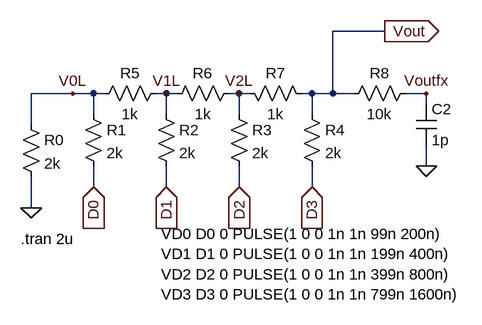
[diagram p0: schematic 4Bit_R2R_DAC.asc]
4Bit_R2R_DAC.asc, the LTspice schematic file:
Version 4
SHEET 1 1212 680
WIRE -48 -480 -128 -480
WIRE -528 -384 -592 -384
WIRE -496 -384 -528 -384
WIRE -480 -384 -496 -384
WIRE -384 -384 -400 -384
WIRE -368 -384 -384 -384
WIRE -272 -384 -288 -384
WIRE -256 -384 -272 -384
WIRE -160 -384 -176 -384
WIRE -128 -384 -128 -480
WIRE -128 -384 -160 -384
WIRE -96 -384 -128 -384
WIRE 16 -384 -16 -384
WIRE 16 -368 16 -384
WIRE -496 -352 -496 -384
WIRE -384 -352 -384 -384
WIRE -272 -352 -272 -384
WIRE -160 -352 -160 -384
WIRE -592 -336 -592 -384
WIRE 16 -272 16 -304
WIRE -496 -240 -496 -272
WIRE -384 -240 -384 -272
WIRE -272 -240 -272 -272
WIRE -160 -240 -160 -272
WIRE -592 -208 -592 -256
FLAG -592 -208 0
FLAG -496 -240 D0
IOPIN -496 -240 In
FLAG 16 -272 0
FLAG 16 -384 Voutfx
FLAG -384 -240 D1
IOPIN -384 -240 In
FLAG -272 -240 D2
IOPIN -272 -240 In
FLAG -160 -240 D3
IOPIN -160 -240 In
FLAG -48 -480 Vout
IOPIN -48 -480 Out
FLAG -528 -384 V0L
FLAG -384 -384 V1L
FLAG -272 -384 V2L
SYMBOL res -608 -352 R0
SYMATTR InstName R0
SYMATTR Value 2k
SYMBOL res -512 -368 R0
SYMATTR InstName R1
SYMATTR Value 2k
SYMBOL res -496 -368 R270
WINDOW 0 32 56 VTop 2
WINDOW 3 0 56 VBottom 2
SYMATTR InstName R5
SYMATTR Value 1k
SYMBOL res 0 -400 R90
WINDOW 0 0 56 VBottom 2
WINDOW 3 32 56 VTop 2
SYMATTR InstName R8
SYMATTR Value 10k
SYMBOL cap 0 -368 R0
SYMATTR InstName C2
SYMATTR Value 1p
SYMBOL res -400 -368 R0
SYMATTR InstName R2
SYMATTR Value 2k
SYMBOL res -384 -368 R270
WINDOW 0 32 56 VTop 2
WINDOW 3 0 56 VBottom 2
SYMATTR InstName R6
SYMATTR Value 1k
SYMBOL res -288 -368 R0
SYMATTR InstName R3
SYMATTR Value 2k
SYMBOL res -160 -368 M270
WINDOW 0 32 56 VTop 2
WINDOW 3 0 56 VBottom 2
SYMATTR InstName R7
SYMATTR Value 1k
SYMBOL res -176 -368 R0
SYMATTR InstName R4
SYMATTR Value 2k
TEXT -392 -168 Left 2 !VD0 D0 0 PULSE(1 0 0 1n 1n 99n 200n)\nVD1 D1 0 PULSE(1 0 0 1n 1n 199n 400n)\nVD2 D2 0 PULSE(1 0 0 1n 1n 399n 800n)\nVD3 D3 0 PULSE(1 0 0 1n 1n 799n 1600n)
TEXT -608 -160 Left 2 !.tran 2u

The netlist it stands for:
* 4Bit_R2R_DAC.asc
R0 V0L 0 2k
R1 V0L D0 2k
R5 V0L V1L 1k
R8 Voutfx Vout 10k
C2 Voutfx 0 1p
R2 V1L D1 2k
R6 V1L V2L 1k
R3 V2L D2 2k
R7 Vout V2L 1k
R4 Vout D3 2k
VD0 D0 0 PULSE(1 0 0 1n 1n 99n 200n)
VD1 D1 0 PULSE(1 0 0 1n 1n 199n 400n)
VD2 D2 0 PULSE(1 0 0 1n 1n 399n 800n)
VD3 D3 0 PULSE(1 0 0 1n 1n 799n 1600n)
.tran 2u
.backanno
.end